# Altium schematic sheet esp.SchDoc
size A4; SheetNumber: 2; SheetTotal: 2
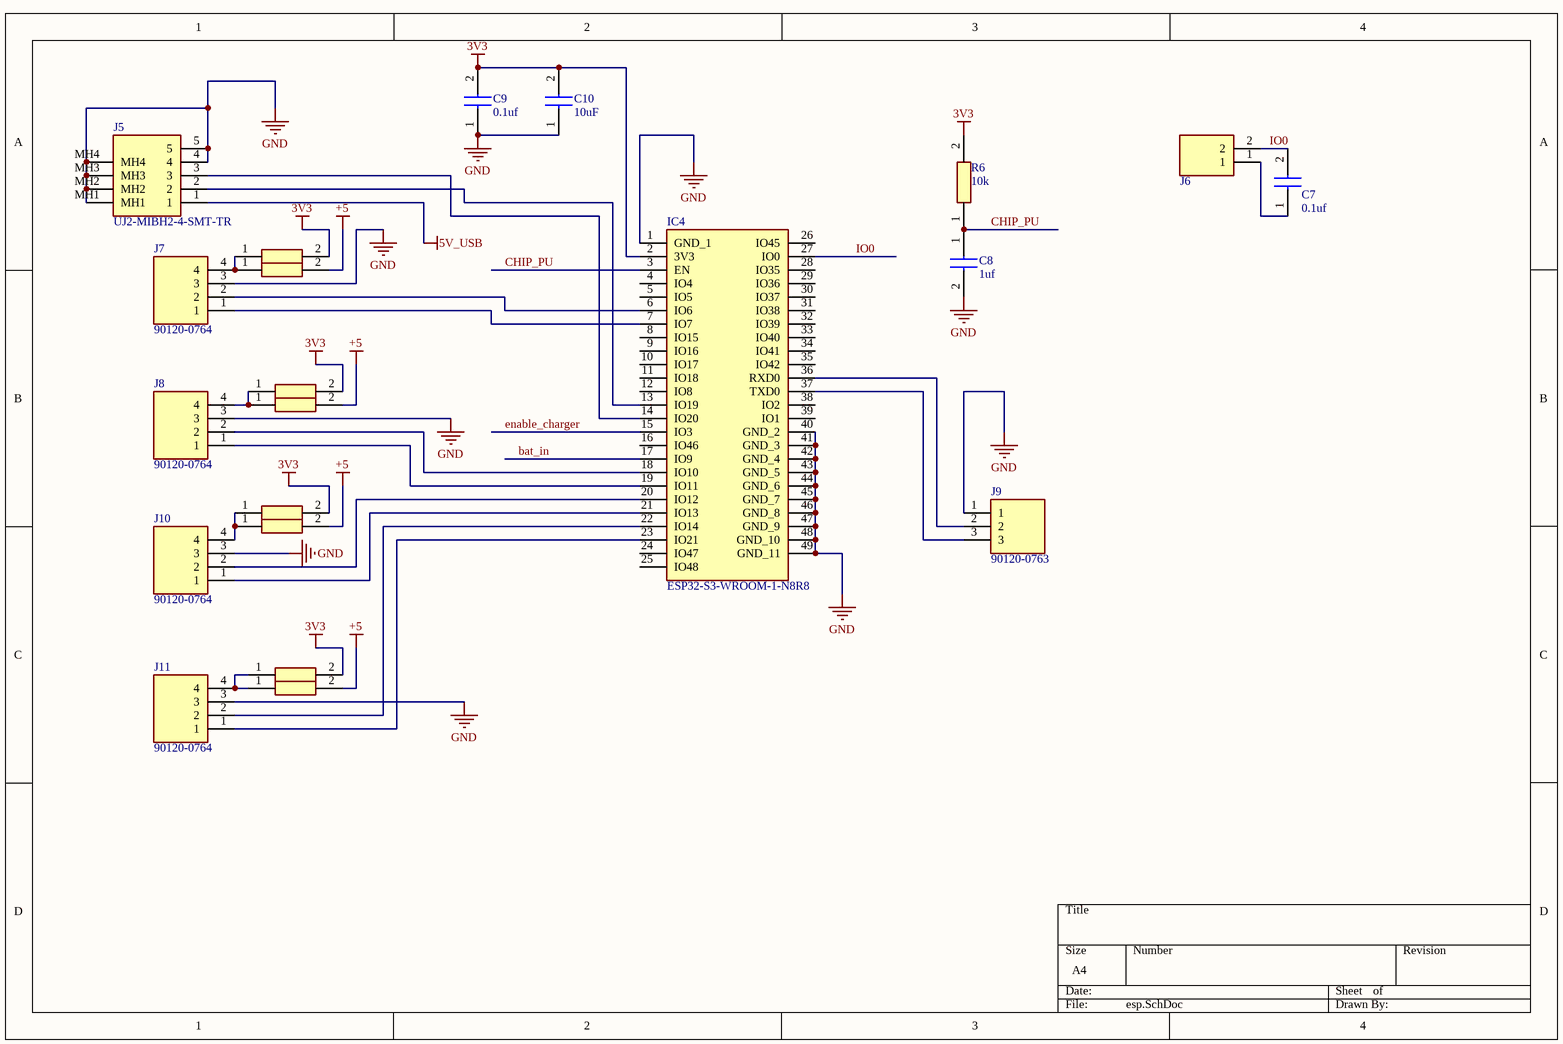
[diagram p0: esp.SchDoc]

## Parts
C7  0.1uf  [C0805]
C8  1uf  [C0805]
C9  0.1uf  [CAPC2012X145N]
C10  10uF  [CAPC2114X145N]
IC4  ESP32-S3-WROOM-1-N8R8  [ESP32S3WROOM1N8R8]
J5  UJ2-MIBH2-4-SMT-TR  [UJ2MIBH24SMTTR]
J6  10129378-902001BLF  [HDRV2W67P0X254_1X2_508X241X843P]  (value not drawn)
J7  90120-0764  [HDRV4W90P0X254_1X4_994X249X560P]
J8  90120-0764  [HDRV4W90P0X254_1X4_994X249X560P]
J9  90120-0763  [HDRV3W90P0X254_1X3_740X249X560P]
J10  90120-0764  [HDRV4W90P0X254_1X4_994X249X560P]
J11  90120-0764  [HDRV4W90P0X254_1X4_994X249X560P]
R6  10k  [RESC2012X65N]
R7  CRCW08050000Z0EB  [RESC2012X50N]  (value not drawn)
R8  CRCW08050000Z0EB  [RESC2012X50N]  (value not drawn)
R9  CRCW08050000Z0EB  [RESC2012X50N]  (value not drawn)
R10  CRCW08050000Z0EB  [RESC2012X50N]  (value not drawn)
R11  CRCW08050000Z0EB  [RESC2012X50N]  (value not drawn)
R12  CRCW08050000Z0EB  [RESC2012X50N]  (value not drawn)
R13  CRCW08050000Z0EB  [RESC2012X50N]  (value not drawn)
R14  CRCW08050000Z0EB  [RESC2012X50N]  (value not drawn)

## Nets
3V3: C9.2 C10.2 IC4.2(3V3) R6.2 R7.2 R9.2 R11.2 R13.2
5V_USB: J5.1
+5: R8.2 R10.2 R12.2 R14.2
GND: C8.2 C9.1 C10.1 IC4.1(GND_1) IC4.40(GND_2) IC4.41(GND_3) IC4.42(GND_4) IC4.43(GND_5) IC4.44(GND_6) IC4.45(GND_7) IC4.46(GND_8) IC4.47(GND_9) IC4.48(GND_10) IC4.49(GND_11) J5.4 J5.5 J5.MH1 J5.MH2 J5.MH3 J5.MH4 J7.3 J8.3 J9.1 J10.3 J11.3
bat_in: IC4.17(IO9)
CHIP_PU: C8.1 IC4.3(EN) R6.1
enable_charger: IC4.15(IO3)
IO0: C7.2 IC4.27(IO0) J6.2
NetC7_1: C7.1 J6.1
NetIC4_6: IC4.6(IO6) J7.2
NetIC4_7: IC4.7(IO7) J7.1
NetIC4_13: IC4.13(IO19) J5.2
NetIC4_14: IC4.14(IO20) J5.3
NetIC4_18: IC4.18(IO10) J8.2
NetIC4_19: IC4.19(IO11) J8.1
NetIC4_20: IC4.20(IO12) J10.2
NetIC4_21: IC4.21(IO13) J10.1
NetIC4_22: IC4.22(IO14) J11.2
NetIC4_23: IC4.23(IO21) J11.1
NetIC4_36: IC4.36(RXD0) J9.2
NetIC4_37: IC4.37(TXD0) J9.3
NetJ7_4: J7.4 R7.1 R8.1
NetJ8_4: J8.4 R9.1 R10.1
NetJ10_4: J10.4 R11.1 R12.1
NetJ11_4: J11.4 R13.1 R14.1

Not connected (* = marked no-connect by the designer): IC4 4(IO4) 5(IO5) 8(IO15) 9(IO16) 10(IO17) 11(IO18) 12(IO8) 16(IO46) 24(IO47) 25(IO48) 26(IO45) 28(IO35) 29(IO36) 30(IO37) 31(IO38) 32(IO39) 33(IO40) 34(IO41) 35(IO42) 38(IO2) 39(IO1)

## Library data of the parts
C7 C8 = C0805C104J5RACTM: Capacitor; Manufacturer_Name: KEMET; Datasheet Link: https://content.kemet.com/datasheets/KEM_C1002_X7R_SMD.pdf; Height: 1.1mm; Manufacturer_Part_Number: C0805C104J5RACTM
C9 = VJ0805Y104KXAAT: Capacitor; Manufacturer_Name: Vishay; Datasheet Link: http://www.vishay.com/docs/45226/vj31xrohsautomlcc.pdf; Height: 1.45mm; Manufacturer_Part_Number: VJ0805Y104KXAAT; Mouser Part Number: 77-VJ0805Y104KXAAT; Mouser Price/Stock: https://www.mouser.co.uk/ProductDetail/Vishay-Vitramon/VJ0805Y104KXAAT?qs=mS8Fuotq4gGV9PmUlyRo%2FA%3D%3D; Arrow Part Number: VJ0805Y104KXAAT; Arrow Price/Stock: https://www.arrow.com/en/products/vj0805y104kxaat/vishay
C10 = LMR212BD7106KG-T: Capacitor; Manufacturer_Name: TAIYO YUDEN; Datasheet Link: https://www.mouser.de/datasheet/2/396/TAIY_S_A0012830329_1-2514546.pdf; Height: 1.45mm; Manufacturer_Part_Number: LMR212BD7106KG-T; Mouser Part Number: 963-LMR212BD7106KG-T; Mouser Price/Stock: https://www.mouser.co.uk/ProductDetail/Taiyo-Yuden/LMR212BD7106KG-T?qs=DRkmTr78QATXuUQGmCCYPQ%3D%3D
IC4 = ESP32-S3-WROOM-1-N8R8: Integrated Circuit; Manufacturer_Name: Espressif Systems; Datasheet Link: https://www.espressif.com/sites/default/files/documentation/esp32-s3-wroom-1_wroom-1u_datasheet_en.pdf; Height: 3.25mm; Manufacturer_Part_Number: ESP32-S3-WROOM-1-N8R8; Mouser Part Number: 356-EP32S3WROOM1N8R8; Mouser Price/Stock: https://www.mouser.co.uk/ProductDetail/Espressif-Systems/ESP32-S3-WROOM-1-N8R8?qs=7D1LtPJG0i3%2F28hKFavOpQ%3D%3D
J5 = UJ2-MIBH2-4-SMT-TR: Connector; Manufacturer_Name: CUI Inc.; Datasheet Link: https://www.cui.com/product/resource/digikeypdf/uj2-mibh2-4-smt.pdf; Height: 2.5mm; Manufacturer_Part_Number: UJ2-MIBH2-4-SMT-TR; Mouser Part Number: 490-UJ2-MIBH2-4-SMT; Mouser Price/Stock: https://www.mouser.co.uk/ProductDetail/CUI-Devices/UJ2-MIBH2-4-SMT-TR?qs=5mqXD9RfOg1yxHIpPvPxvQ%3D%3D; Arrow Part Number: UJ2-MIBH2-4-SMT-TR; Arrow Price/Stock: https://www.arrow.com/en/products/uj2-mibh2-4-smt-tr/cui-devices?region=nac
J6 = 10129378-902001BLF: Connector; Manufacturer_Name: Amphenol; Datasheet Link: https://www.mouser.co.uk/datasheet/2/18/10129378-1530218.pdf; Height: 8.43mm; Manufacturer_Part_Number: 10129378-902001BLF; Mouser Part Number: 649-1012937890201BLF; Mouser Price/Stock: https://www.mouser.co.uk/ProductDetail/Amphenol-FCI/10129378-902001BLF?qs=0lQeLiL1qybv6C1q0T3%2FPw%3D%3D; Arrow Part Number: 10129378-902001BLF; Arrow Price/Stock: https://www.arrow.com/en/products/10129378-902001blf/amphenol-fci?region=nac
J7 J8 J10 J11 = 90120-0764: Connector; Manufacturer_Name: Molex; Datasheet Link: https://www.molex.com/webdocs/datasheets/pdf/en-us/0901200764_PCB_HEADERS.pdf; Height: 5.6mm; Manufacturer_Part_Number: 90120-0764; Mouser Part Number: 538-90120-0764; Mouser Price/Stock: https://www.mouser.co.uk/ProductDetail/Molex/90120-0764?qs=QSnLD11VNirsMTdnHEPG3Q%3D%3D
J9 = 90120-0763: Connector; Manufacturer_Name: Molex; Datasheet Link: http://www.molex.com/webdocs/datasheets/pdf/en-us/0901200763_PCB_HEADERS.pdf; Height: 5.6mm; Manufacturer_Part_Number: 90120-0763; Mouser Part Number: 538-90120-0763; Mouser Price/Stock: https://www.mouser.co.uk/ProductDetail/Molex/90120-0763?qs=BLN8Q0P37WbEQIErCRrCtQ%3D%3D
R6 = CPF0805B10K5E1: Resistor; Manufacturer_Name: TE Connectivity; Datasheet Link: https://datasheet.datasheetarchive.com/originals/distributors/DKDS-21/401696.pdf; Height: 0.65mm; Manufacturer_Part_Number: CPF0805B10K5E1; Mouser Part Number: 279-CPF0805B10K5E1; Mouser Price/Stock: https://www.mouser.com/Search/Refine.aspx?Keyword=279-CPF0805B10K5E1
R7-R14 = CRCW08050000Z0EB: Resistor; Manufacturer_Name: Vishay; Datasheet Link: http://www.vishay.com/docs/20035/dcrcwe3.pdf; Height: 0.5mm; Manufacturer_Part_Number: CRCW08050000Z0EB; Mouser Part Number: 71-CRCW08050000Z0EB; Mouser Price/Stock: https://www.mouser.co.uk/ProductDetail/Vishay-Dale/CRCW08050000Z0EB?qs=LOX6nxTstiY0zjlRUzYOBg%3D%3D; Arrow Part Number: CRCW08050000Z0EB; Arrow Price/Stock: https://www.arrow.com/en/products/crcw08050000z0eb/vishay